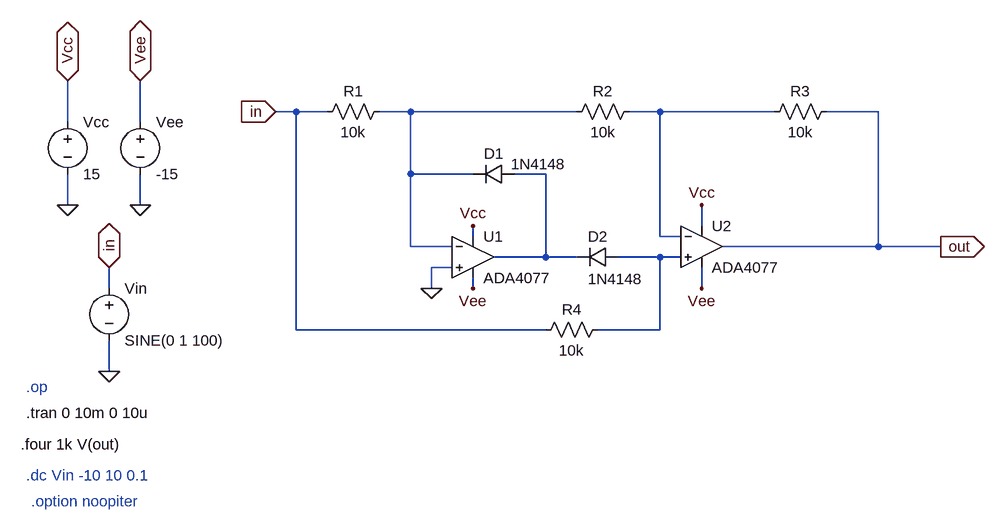
[diagram p0: schematic etaj4_FWR.asc]
etaj4_FWR.asc, the LTspice schematic file:
Version 4.1
SHEET 1 992 680
WIRE -224 32 -256 32
WIRE -176 32 -224 32
WIRE -48 32 -96 32
WIRE 208 32 -48 32
WIRE 336 32 288 32
WIRE 512 32 336 32
WIRE 672 32 592 32
WIRE -576 48 -576 -16
WIRE -464 48 -464 -16
WIRE -48 128 -48 32
WIRE 48 128 -48 128
WIRE 160 128 112 128
WIRE -576 176 -576 128
WIRE -464 176 -464 128
WIRE 400 208 400 176
WIRE 48 224 48 208
WIRE 336 224 336 32
WIRE 368 224 336 224
WIRE -48 240 -48 128
WIRE 16 240 -48 240
WIRE 672 240 672 32
WIRE 672 240 432 240
WIRE 768 240 672 240
WIRE 160 256 160 128
WIRE 160 256 80 256
WIRE 208 256 160 256
WIRE 336 256 272 256
WIRE 368 256 336 256
WIRE 16 272 -16 272
WIRE -512 304 -512 272
WIRE -16 304 -16 272
WIRE 48 304 48 288
WIRE 400 304 400 272
WIRE -224 368 -224 32
WIRE 160 368 -224 368
WIRE 336 368 336 256
WIRE 336 368 240 368
WIRE -512 432 -512 384
FLAG -256 32 in
IOPIN -256 32 In
FLAG -16 304 0
FLAG 768 240 out
IOPIN 768 240 Out
FLAG -512 432 0
FLAG -576 176 0
FLAG -464 176 0
FLAG -576 -16 Vcc
IOPIN -576 -16 BiDir
FLAG -464 -16 Vee
IOPIN -464 -16 BiDir
FLAG -512 272 in
IOPIN -512 272 BiDir
FLAG 48 208 Vcc
FLAG 48 304 Vee
FLAG 400 176 Vcc
FLAG 400 304 Vee
SYMBOL res -80 16 R90
WINDOW 0 0 56 VBottom 2
WINDOW 3 32 56 VTop 2
SYMATTR InstName R1
SYMATTR Value 10k
SYMBOL res 304 16 R90
WINDOW 0 0 56 VBottom 2
WINDOW 3 32 56 VTop 2
SYMATTR InstName R2
SYMATTR Value 10k
SYMBOL res 608 16 R90
WINDOW 0 0 56 VBottom 2
WINDOW 3 32 56 VTop 2
SYMATTR InstName R3
SYMATTR Value 10k
SYMBOL OpAmps\\ADA4077 48 192 R0
SYMATTR InstName U1
SYMBOL diode 112 112 R90
WINDOW 0 0 32 VBottom 2
WINDOW 3 -15 -37 VTop 2
SYMATTR InstName D1
SYMATTR Value 1N4148
SYMBOL diode 272 240 R90
WINDOW 0 0 32 VBottom 2
WINDOW 3 34 5 VTop 2
SYMATTR InstName D2
SYMATTR Value 1N4148
SYMBOL OpAmps\\ADA4077 400 176 R0
SYMATTR InstName U2
SYMBOL res 256 352 R90
WINDOW 0 0 56 VBottom 2
WINDOW 3 32 56 VTop 2
SYMATTR InstName R4
SYMATTR Value 10k
SYMBOL voltage -576 32 R0
SYMATTR InstName Vcc
SYMATTR Value 15
SYMBOL voltage -464 32 R0
SYMATTR InstName Vee
SYMATTR Value -15
SYMBOL voltage -512 288 R0
WINDOW 123 0 0 Left 0
WINDOW 39 0 0 Left 0
SYMATTR InstName Vin
SYMATTR Value SINE(0 1 100)
TEXT -640 456 Left 2 ;.op
TEXT -640 496 Left 2 !.tran 0 10m 0 10u
TEXT -648 544 Left 2 !.four 1k V(out)
TEXT -640 592 Left 2 ;.dc Vin -10 10 0.1
TEXT -632 632 Left 2 ;.option noopiter

The netlist it stands for:
* etaj4_FWR.asc
R1 N001 in 10k
R2 N002 N001 10k
R3 out N002 10k
X§U1 0 N001 Vcc Vee N003 ADA4077  ; pins In+ In- V+ V- OUT
D1 N003 N001 1N4148
D2 N004 N003 1N4148
X§U2 N004 N002 Vcc Vee out ADA4077  ; pins In+ In- V+ V- OUT
R4 N004 in 10k
Vcc Vcc 0 15
Vee Vee 0 -15
Vin in 0 SINE(0 1 100)
.model D D
.lib standard.dio
* .op
.tran 0 10m 0 10u
.four 1k V(out)
* .dc Vin -10 10 0.1
* .option noopiter
.backanno
.end